# Altium schematic sheet mia.SchDoc
size A; SheetNumber: 1; SheetTotal: 1
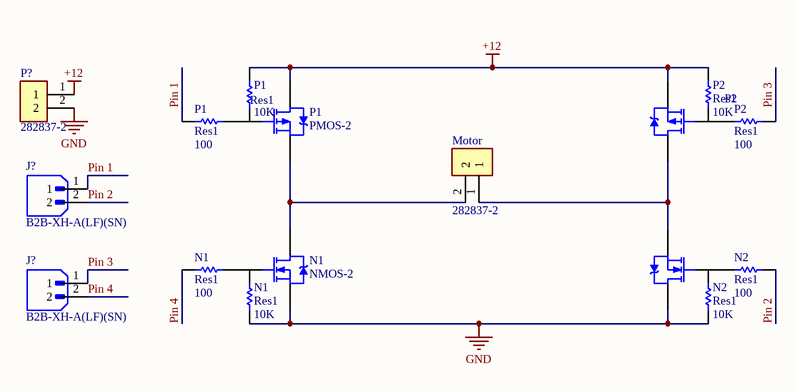
[diagram p0: mia.SchDoc]

## Parts
(Parts that share a designator on the sheet are numbered #1, #2 ... from top to bottom, then left to right.)
J?#1  B2B-XH-A(LF)(SN)  [JST_B2B-XH-A(LF)(SN)]
J?#2  B2B-XH-A(LF)(SN)  [JST_B2B-XH-A(LF)(SN)]
Motor  282837-2  [TE_282837-2]
N1#1  Res1  value 100  [AXIAL-0.3]
N1#2  NMOS-2  [TO-220AB]
N1#3  Res1  value 10K  [AXIAL-0.3]
N2#1  Res1  value 100  [AXIAL-0.3]
N2#2  NMOS-2  [TO-220AB]  (value not drawn)
N2#3  Res1  value 10K  [AXIAL-0.3]
P1#1  Res1  value 100  [AXIAL-0.3]
P1#2  Res1  value 10K  [AXIAL-0.3]
P1#3  PMOS-2  [TO-220AB]
P2#1  Res1  value 10K  [AXIAL-0.3]
P2#2  Res1  value 100  [AXIAL-0.3]
P2#3  PMOS-2  [TO-220AB]  (value not drawn)
P?  282837-2  [TE_282837-2]

## Nets
+12: P1#2.2 P1#3.2(D) P2#1.2 P2#3.3(S) P?.1
GND: N1#2.3(S) N1#3.1 N2#2.2(D) N2#3.1 P?.2
Pin 1: J?#1.1 P1#1.1
Pin 2: J?#1.2 N2#1.2
Pin 3: J?#2.1 P2#2.2
Pin 4: J?#2.2 N1#1.1
NetMotor_1: Motor.1 N2#2.3(S) P2#3.2(D)
NetMotor_2: Motor.2 N1#2.2(D) P1#3.3(S)
NetN1#1_2: N1#1.2 N1#2.1(G)
NetN2#1_1: N2#1.1 N2#2.1(G)
NetP1#1_2: P1#1.2 P1#3.1(G)
NetP2#2_1: P2#2.1 P2#3.1(G)

Not connected (* = marked no-connect by the designer): N1#3 2; N2#3 2; P1#2 1; P2#1 1

## Library data of the parts
J?#1 J?#2 = B2B-XH-A(LF)(SN): Connector Header Through Hole 2 position 0.098 (2.50mm); MF: JST Sales America Inc.; SnapEDA_Link: https://www.snapeda.com/parts/B2B-XH-A(LF)(SN)/JST+Sales+America+Inc./view-part/?ref=snap; Package: None; Value: *; MP: B2B-XH-A(LF)(SN); Check_prices: https://www.snapeda.com/parts/B2B-XH-A(LF)(SN)/JST+Sales+America+Inc./view-part/?ref=eda
Motor P? = 282837-2: Ð Ð°Ð·ÑŠÐµÐ¼Ð½Ñ‹Ðµ ÐºÐ»ÐµÐ¼Ð¼Ð½Ñ‹Ðµ ÐºÐ¾Ð»Ð¾Ð´ÐºÐ¸ Ð Ð¾Ð·ÐµÑ‚ÐºÐ° 2 Ð¿Ð¾Ð»Ð¾Ð¶ÐµÐ½Ð¸Ñ 5,08 Ð¼Ð¼ ÐŸÑ€Ð¸Ð¿Ð¾Ð¹ Ð¿Ñ€ÑÐ¼Ð¾Ð¹ Ñ‡ÐµÑ€ÐµÐ· Ð¾Ñ‚Ð²ÐµÑ€ÑÑ‚Ð¸Ðµ 13,5 Ð / ÐºÐ¾Ð½Ñ‚Ð°ÐºÑ‚; MF: TE Connectivity; SnapEDA_Link: https://www.snapeda.com/parts/282837-2/TE+Connectivity+AMP+Connectors/view-part/?ref=snap; Price: None; Check_prices: https://www.snapeda.com/parts/282837-2/TE+Connectivity+AMP+Connectors/view-part/?ref=eda; Purchase-URL: https://pricing.snapeda.com/search/part/282837-2/?ref=eda; MP: 282837-2; Value: *; Availability: In Stock; Package: None
N1#1 N1#3 N2#1 N2#3 P1#1 P1#2 P2#1 P2#2 = Res1: Resistor; Published: 8-Jun-2000; LatestRevisionDate: 17-Jul-2002; LatestRevisionNote: Re-released for DXP Platform.; PackageReference: AXIAL-0.3; Publisher: Altium Limited; PackageDescription: Axial Device, Thru-Hole; 2 Leads; 0.3 in Pin Spacing
N1#2 N2#2 = NMOS-2: N-Channel Power MOSFET; Note: Pin 2 is electrically connected to pin 4.; Published: 8-Jun-2000; LatestRevisionDate: 17-Jul-2002; LatestRevisionNote: Re-released for DXP Platform.; DatasheetVersion: PD-9.814; PackageVersion: Feb-1997; PackageReference: TO-220AB; Publisher: Altium Limited; PackageDescription: TO, Thru-Hole, Vertical, Heatsink Mounted; 3 In-Line Leads; Pitch 2.54 mm; ComponentLink1Description: Manufacturer Link; ComponentLink1URL: http://www.irf.com/
P1#3 P2#3 = PMOS-2: P-Channel Power MOSFET; Note: Pin 4 not drawn and electrically connected to Pin 2.; Published: 8-Jun-2000; LatestRevisionDate: 17-Jul-2002; LatestRevisionNote: Re-released for DXP Platform.; DatasheetVersion: PD-9.390D; PackageVersion: Feb-1997; PackageReference: TO-220AB; Publisher: Altium Limited; PackageDescription: TO, Thru-Hole, Vertical, Heatsink Mounted; 3 In-Line Leads; Pitch 2.54 mm; ComponentLink1Description: Manufacturer Link; ComponentLink1URL: http://www.irf.com/